# EAGLE schematic tempSensorV1 (EAGLE 7.2.0)
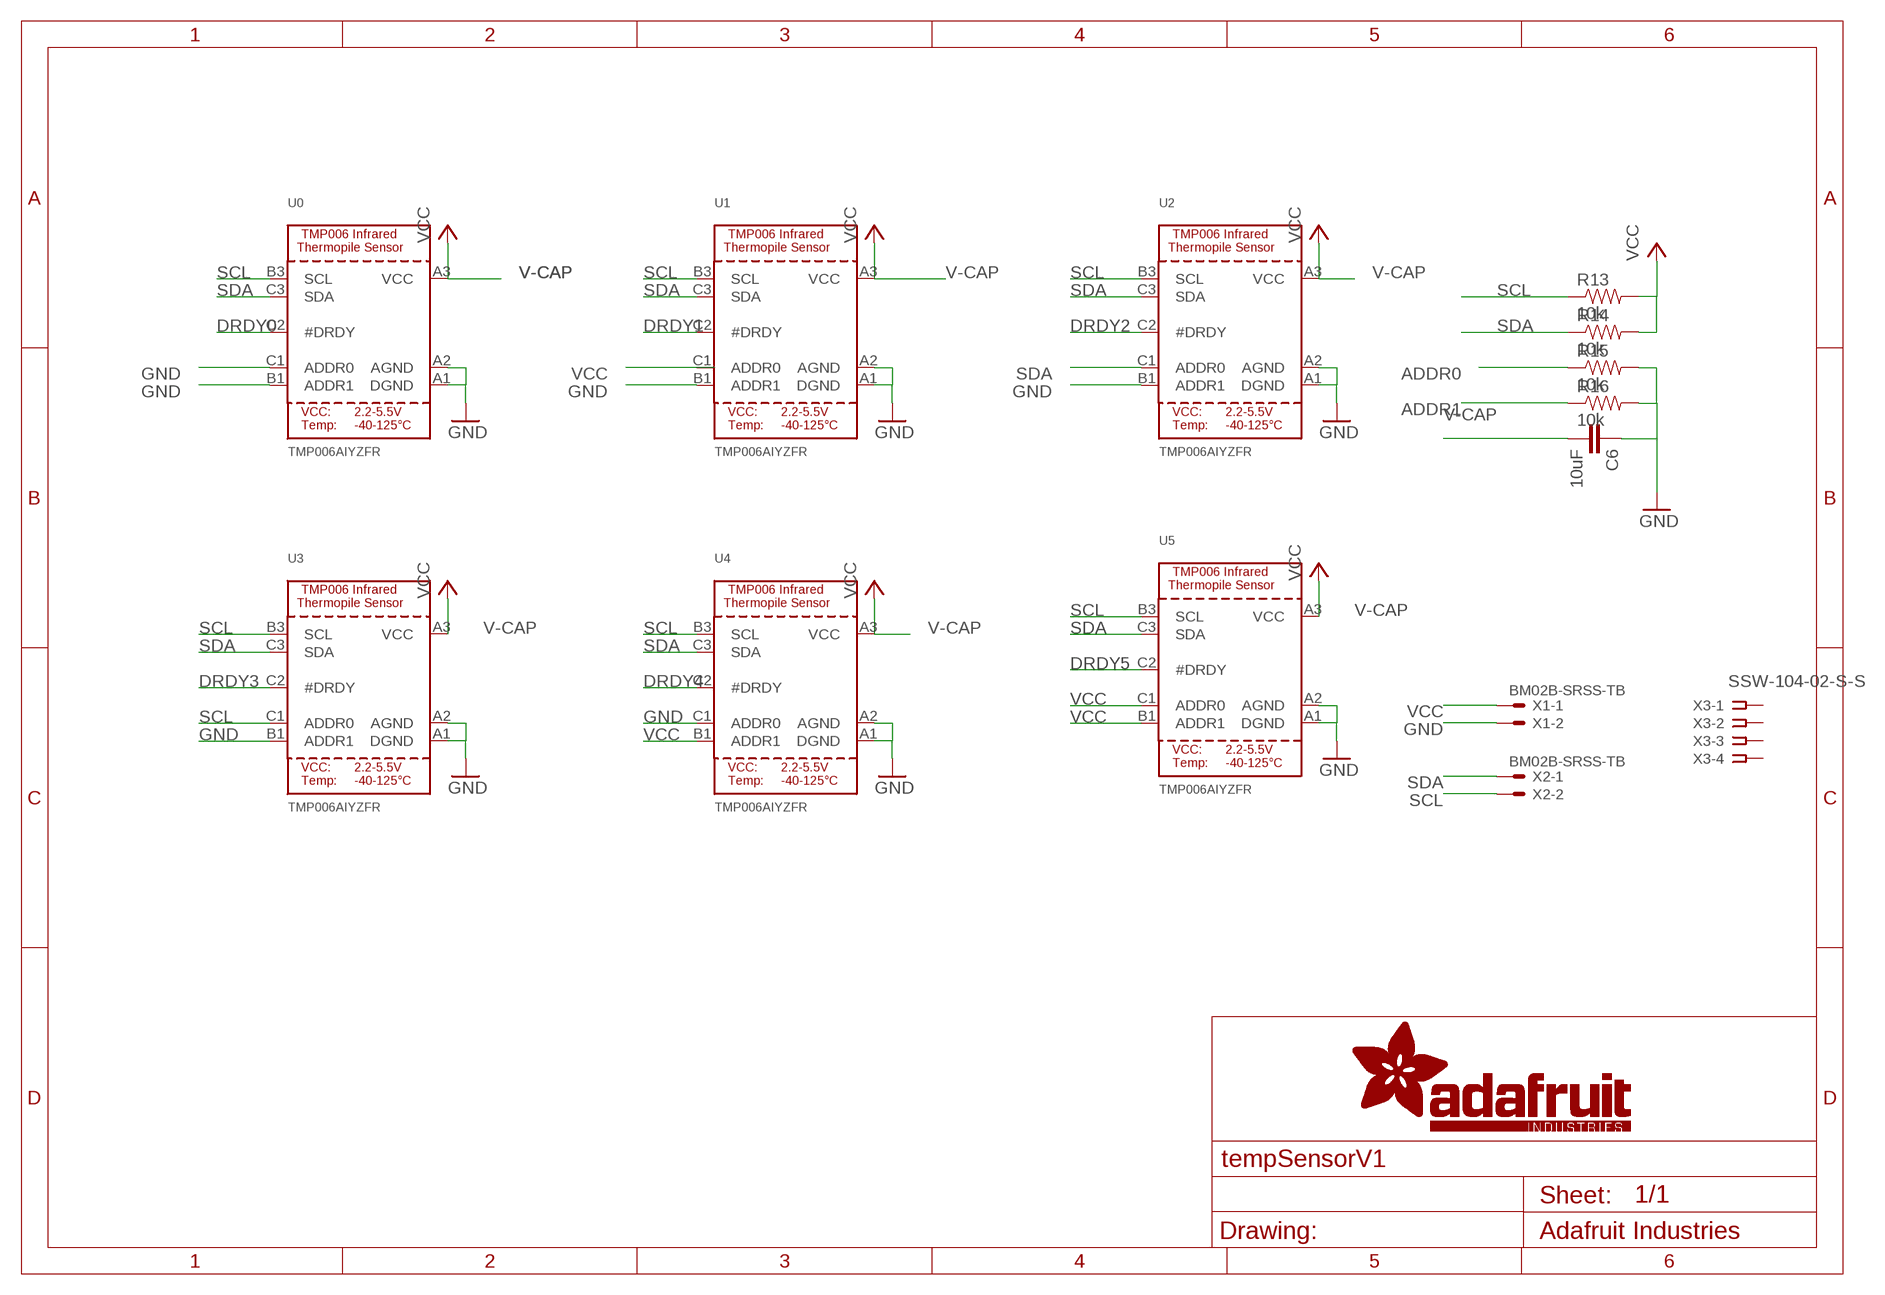
[diagram p0: schematic, sheet 1]

## Parts
C6  10uF  10UF-6.3V-20%(0603)  [0603-CAP]
R13  10k  RESISTOR0402  [0402-RES]
R14  10k  RESISTOR0402  [0402-RES]
R15  10k  RESISTOR0402  [0402-RES]
R16  10k  RESISTOR0402  [0402-RES]
U0  TMP006AIYZFR  TMP006  [WCSP-8]
U1  TMP006AIYZFR  TMP006  [WCSP-8]
U2  TMP006AIYZFR  TMP006  [WCSP-8]
U3  TMP006AIYZFR  TMP006  [WCSP-8]
U4  TMP006AIYZFR  TMP006  [WCSP-8]
U5  TMP006AIYZFR  TMP006  [WCSP-8]
X1  BM02B-SRSS-TB  [BM02B-SRSS-TB]
X2  BM02B-SRSS-TB  [BM02B-SRSS-TB]
X3  SSW-104-02-S-S  [SSW-104-02-S-S]

## Nets
ADDR0: R15.1
ADDR1: R16.1
DRDY0: U0.C2(#DRDY)
DRDY1: U1.C2(#DRDY)
DRDY2: U2.C2(#DRDY)
DRDY3: U3.C2(#DRDY)
DRDY4: U4.C2(#DRDY)
DRDY5: U5.C2(#DRDY)
GND: C6.1 R15.2 R16.2 U0.A1(DGND) U0.A2(AGND) U0.B1(ADDR1) U0.C1(ADDR0) U1.A1(DGND) U1.A2(AGND) U1.B1(ADDR1) U2.A1(DGND) U2.A2(AGND) U2.B1(ADDR1) U3.A1(DGND) U3.A2(AGND) U3.B1(ADDR1) U4.A1(DGND) U4.A2(AGND) U4.C1(ADDR0) U5.A1(DGND) U5.A2(AGND) X1.2
SCL: R13.1 U0.B3(SCL) U1.B3(SCL) U2.B3(SCL) U3.B3(SCL) U3.C1(ADDR0) U4.B3(SCL) U5.B3(SCL) X2.2
SDA: R14.1 U0.C3(SDA) U1.C3(SDA) U2.C1(ADDR0) U2.C3(SDA) U3.C3(SDA) U4.C3(SDA) U5.C3(SDA) X2.1
V-CAP: C6.2 R13.2 R14.2 U0.A3(VCC) U1.A3(VCC) U2.A3(VCC) U3.A3(VCC) U4.A3(VCC) U5.A3(VCC) ; supply symbol labelled VCC
VCC: U4.B1(ADDR1) U5.B1(ADDR1) U5.C1(ADDR0) X1.1
Unconnected: U1.C1(ADDR0) X3.1 X3.2 X3.3 X3.4

## Library data of the parts
C6 = SparkFun-Capacitors:10UF-6.3V-20%(0603): CAP-11015; PROD_ID: CAP-11015
R13-R16 = SparkFun-Resistors:RESISTOR: Resistor Basic schematic elements and footprints for 0603, 1206, and PTH resistors.
U0 U1-U5 = microbuilder:TMP006: TMP006 Infrared Thermopile Sensor Sensor Voltage: 7 μV/°C Infrared Sensor Range: –40°C to +125°C Source: http://www.ti.com/lit/ds/sbos518b/sbos518b.pdf
X1 X2 = con-jst2:?M02B-SRSS-TB: Disconnectable Crimp style connector, 1.0mm pitch 2 contacts
X3 = con-samtec:SSW-104-02-S-S: THROUGH-HOLE .025" SQ POST SOCKET Source: Samtec SSW.pdf; MPN: SSW-104-02-S-S; OC_FARNELL: unknown; OC_NEWARK: 11P9384